# Altium schematic sheet LCD.SchDoc
size A4
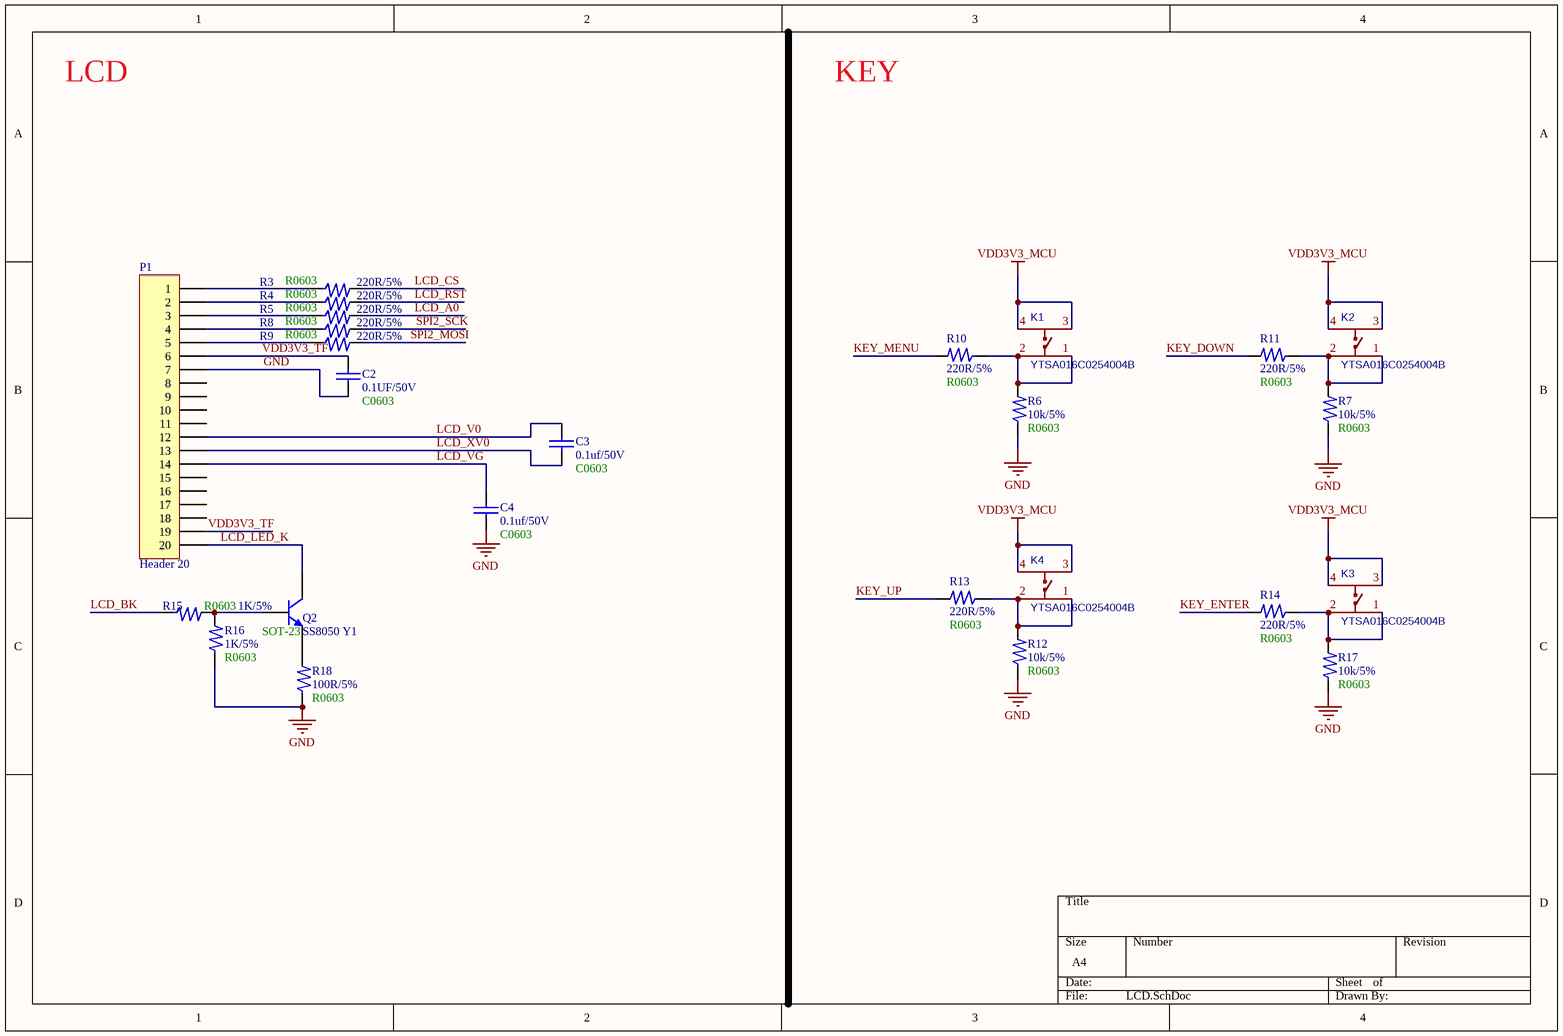
[diagram p0: LCD.SchDoc]

## Parts
C2  0.1UF/50V  Footprint: C0603  [0603_C]
C3  0.1uf/50V  Footprint: C0603  [0603_C]
C4  0.1uf/50V  Footprint: C0603  [0603_C]
K1  YTSA016C0254004B  [SMD6*6*4.5]
K2  YTSA016C0254004B  [SMD6*6*4.5]
K3  YTSA016C0254004B  [SMD6*6*4.5]
K4  YTSA016C0254004B  [SMD6*6*4.5]
P1  Header 20  [LCD]
Q2  SS8050 Y1  Package: SOT-23  [SOT-23(SOT-23-3)]
R3  220R/5%  Footprint: R0603  [0603_R]
R4  220R/5%  Footprint: R0603  [0603_R]
R5  220R/5%  Footprint: R0603  [0603_R]
R6  10k/5%  Footprint: R0603  [0603_R]
R7  10k/5%  Footprint: R0603  [0603_R]
R8  220R/5%  Footprint: R0603  [0603_R]
R9  220R/5%  Footprint: R0603  [0603_R]
R10  220R/5%  Footprint: R0603  [0603_R]
R11  220R/5%  Footprint: R0603  [0603_R]
R12  10k/5%  Footprint: R0603  [0603_R]
R13  220R/5%  Footprint: R0603  [0603_R]
R14  220R/5%  Footprint: R0603  [0603_R]
R15  1K/5%  Footprint: R0603  [0603_R]
R16  1K/5%  Footprint: R0603  [0603_R]
R17  10k/5%  Footprint: R0603  [0603_R]
R18  100R/5%  Footprint: R0603  [0603_R]

## Nets
GND: C2.1 C4.2 P1.7 R6.2 R7.2 R12.2 R16.2 R17.2 R18.2
VDD3V3_MCU: K1.3 K1.4 K2.3 K2.4 K3.3 K3.4 K4.3 K4.4
KEY_DOWN: R11.1
KEY_ENTER: R14.1
KEY_MENU: R10.1
KEY_UP: R13.1
LCD_A0: R5.1
LCD_BK: R15.2
LCD_CS: R3.1
LCD_LED_K: P1.20 Q2.3(C)
LCD_RST: R4.1
LCD_V0: C3.1 P1.12
LCD_VG: C4.1 P1.14
LCD_XV0: C3.2 P1.13
SPI2_MOSI: R9.1
SPI2_SCK: R8.1
VDD3V3_TF: C2.2 P1.6 P1.19
NetK1_1: K1.1 K1.2 R6.1 R10.2
NetK2_1: K2.1 K2.2 R7.1 R11.2
NetK3_1: K3.1 K3.2 R14.2 R17.1
NetK4_1: K4.1 K4.2 R12.1 R13.2
NetP1_1: P1.1 R3.2
NetP1_2: P1.2 R4.2
NetP1_3: P1.3 R5.2
NetP1_4: P1.4 R8.2
NetP1_5: P1.5 R9.2
NetQ2_1: Q2.1(B) R15.1 R16.1
NetQ2_2: Q2.2(E) R18.1

Not connected (* = marked no-connect by the designer): P1 8 9 10 11 15 16 17 18

## Notes on the sheet
- LCD
- KEY

## Library data of the parts
C2-C4 = CAP: Capacitor
K1-K4 = YTSA016C0254004B: BOM_Manufacturer: DGBZ(东莞博众); Contributor: LCSC; BOM_Supplier: LCSC; BOM_Supplier Part: C2764970; BOM_Manufacturer Part: YTSA016C0254004B; BOM_JLCPCB Part Class: Extended Part; spicePre: S; spiceSymbolName: YTSA016C0254004B
P1 = Header 20: Header, 20-Pin; LatestRevisionDate: 17-Jul-2002; LatestRevisionNote: Re-released for DXP Platform.; Publisher: Altium Limited
Q2 = SOT-23 SS8050 Y1: 三极管; ComponentLink1Description: 供应商链接; ComponentLink1URL: http://www.szlcsc.com/product/details_2507.html; Supplier: LC; SuppliersPartNumber: C2150
R3-R18 = 电阻